# EAGLE design bletka_1 (EAGLE 8.2.0)
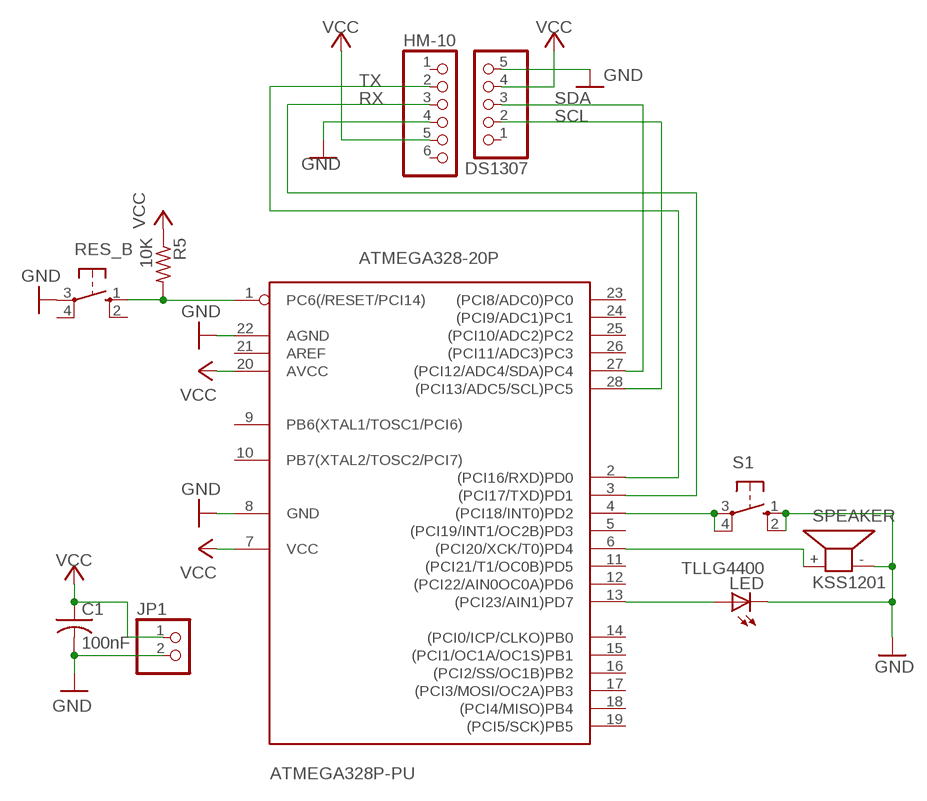
[diagram p0: schematic, sheet 1]

## Parts
ATMEGA328P-PU  ATMEGA328-20P  [DIL28-3]
C1  100nF  C-US050-024X044  [C050-024X044]
DS1307  PINHD-1X5  [1X05]
HM-10  PINHD-1X6  [1X06]
JP1  PINHD-1X2  [1X02]
LED  TLLG4400  [LED3MM]
R5  10K  R-US_0207/10  [0207/10]
RES_B  10-XX  [B3F-10XX]
S1  10-XX  [B3F-10XX]
SPEAKER  KSS1201  [KSS1201]

## Nets
GND: ATMEGA328P-PU.8(GND) ATMEGA328P-PU.22(AGND) C1.2 DS1307.5 HM-10.4 JP1.2 LED.K(C) RES_B.3(P) S1.1(S) S1.2(S1) SPEAKER.-
N$1: ATMEGA328P-PU.4((PCI18/INT0)PD2) S1.3(P) S1.4(P1)
PD4: ATMEGA328P-PU.6((PCI20/XCK/T0)PD4) SPEAKER.+
PD7: ATMEGA328P-PU.13((PCI23/AIN1)PD7) LED.A
RESET: ATMEGA328P-PU.1(PC6(/RESET/PCI14)) R5.2 RES_B.1(S)
RX: ATMEGA328P-PU.3((PCI17/TXD)PD1) HM-10.3
SCL: ATMEGA328P-PU.28((PCI13/ADC5/SCL)PC5) DS1307.2
SDA: ATMEGA328P-PU.27((PCI12/ADC4/SDA)PC4) DS1307.3
TX: ATMEGA328P-PU.2((PCI16/RXD)PD0) HM-10.2
VCC: ATMEGA328P-PU.7(VCC) ATMEGA328P-PU.20(AVCC) C1.1 DS1307.4 HM-10.5 JP1.1 R5.1
Unconnected: ATMEGA328P-PU.5((PCI19/INT1/OC2B)PD3) ATMEGA328P-PU.9(PB6(XTAL1/TOSC1/PCI6)) ATMEGA328P-PU.10(PB7(XTAL2/TOSC2/PCI7)) ATMEGA328P-PU.11((PCI21/T1/OC0B)PD5) ATMEGA328P-PU.12((PCI22/AIN0OC0A)PD6) ATMEGA328P-PU.14((PCI0/ICP/CLKO)PB0) ATMEGA328P-PU.15((PCI1/OC1A/OC1S)PB1) ATMEGA328P-PU.16((PCI2/SS/OC1B)PB2) ATMEGA328P-PU.17((PCI3/MOSI/OC2A)PB3) ATMEGA328P-PU.18((PCI4/MISO)PB4) ATMEGA328P-PU.19((PCI5/SCK)PB5) ATMEGA328P-PU.21(AREF) ATMEGA328P-PU.23((PCI8/ADC0)PC0) ATMEGA328P-PU.24((PCI9/ADC1)PC1) ATMEGA328P-PU.25((PCI10/ADC2)PC2) ATMEGA328P-PU.26((PCI11/ADC3)PC3) DS1307.1 HM-10.1 HM-10.6 RES_B.2(S1) RES_B.4(P1)

## Library data of the parts
ATMEGA328P-PU = atmega328:ATMEGA328*P: MICROCONTROLLER 32 kBytes FLASH 2 kBytes SRAM 1 kBytes EEPROM USART 8-channel 10 bit ADC
C1 = adafruit:C-US: CAPACITOR, American symbol
DS1307 = pinhead:PINHD-1X5: PIN HEADER
HM-10 = pinhead:PINHD-1X6: PIN HEADER
JP1 = pinhead:PINHD-1X2: PIN HEADER
LED = led:TLLG4400: Low Current (2mA) LED 3 mm Tinted Diffused Package color GREEN Source: Data sheet <http://www.farnell.com/datasheets/391098.pdf>; MF: VISHAY SEMICONDUCTOR; OC_FARNELL: 1612435
R5 = adafruit:R-US_: RESISTOR, American symbol
RES_B S1 = switch-omron:10-XX: OMRON SWITCH; MPN: B3F-1000; OC_FARNELL: 176432; OC_NEWARK: 36M3542
SPEAKER = buzzer:KSS1201: SPEAKER Source: Schukat; OC_FARNELL: unknown; OC_NEWARK: unknown

## Net classes
0 default: width 0.5 mm

## Board
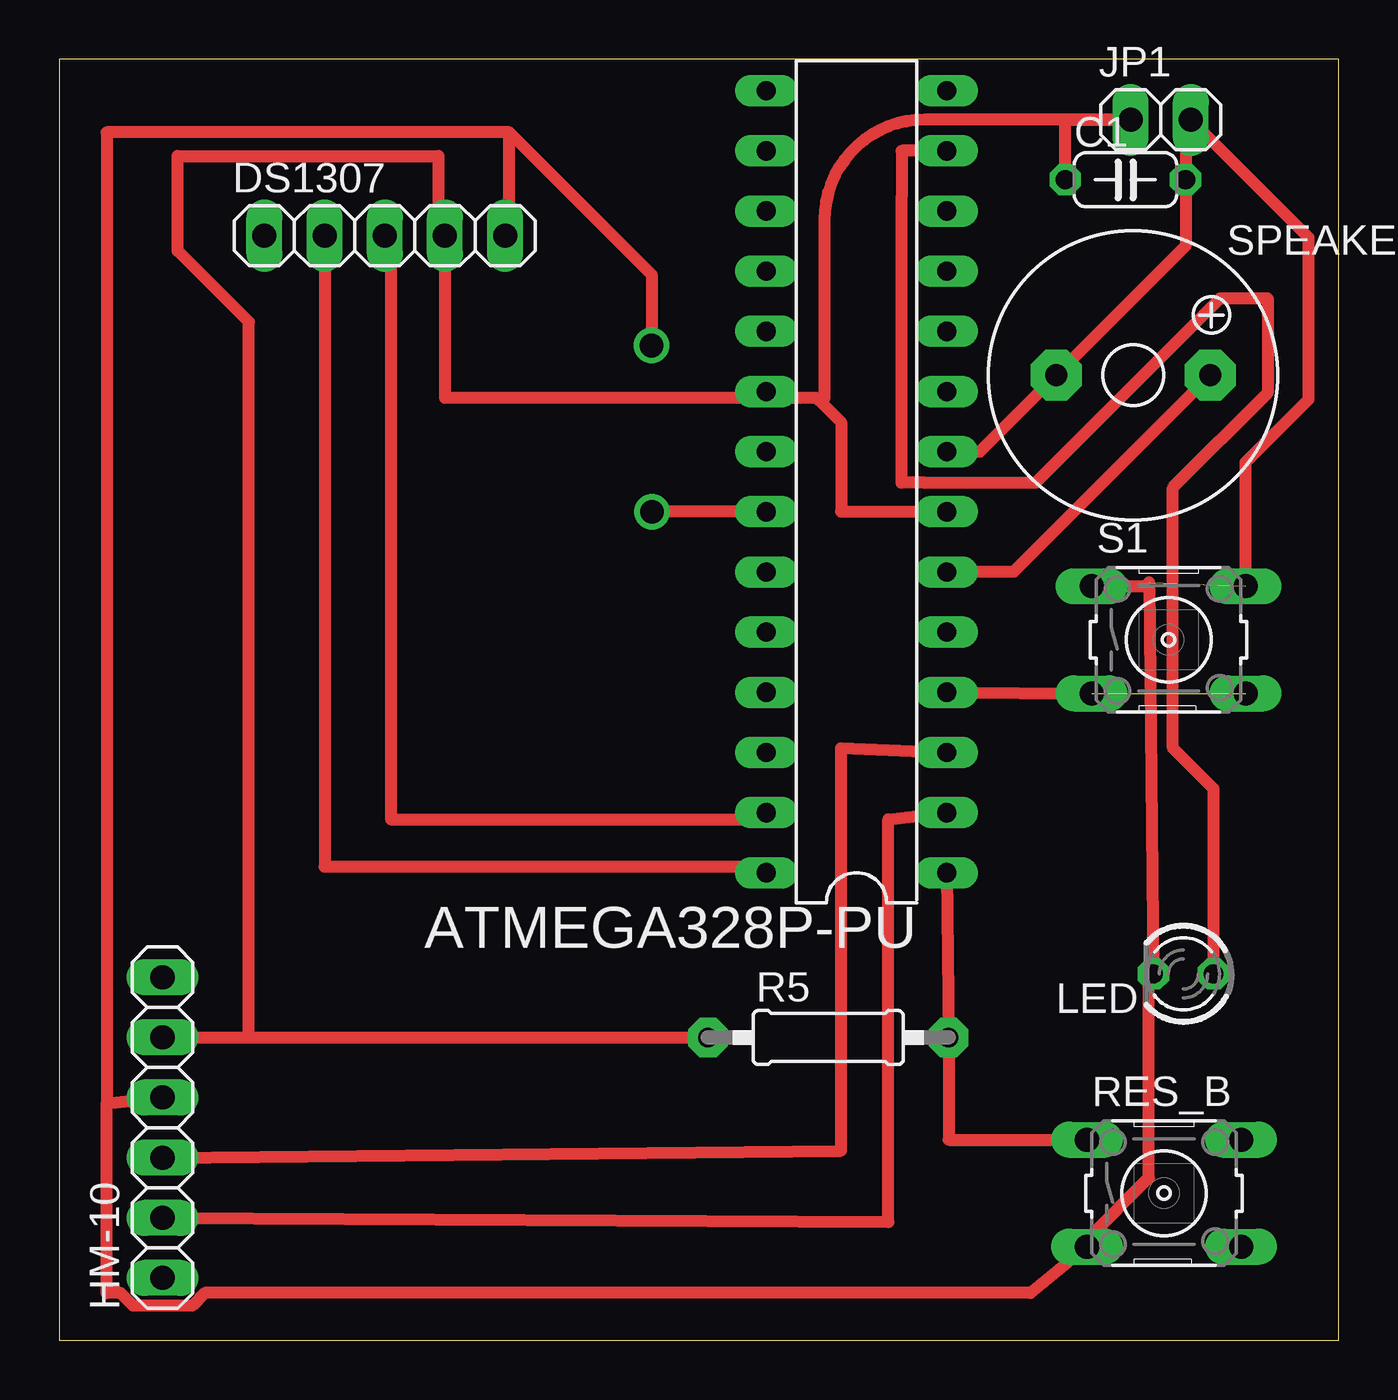
[diagram p1: board, top side]
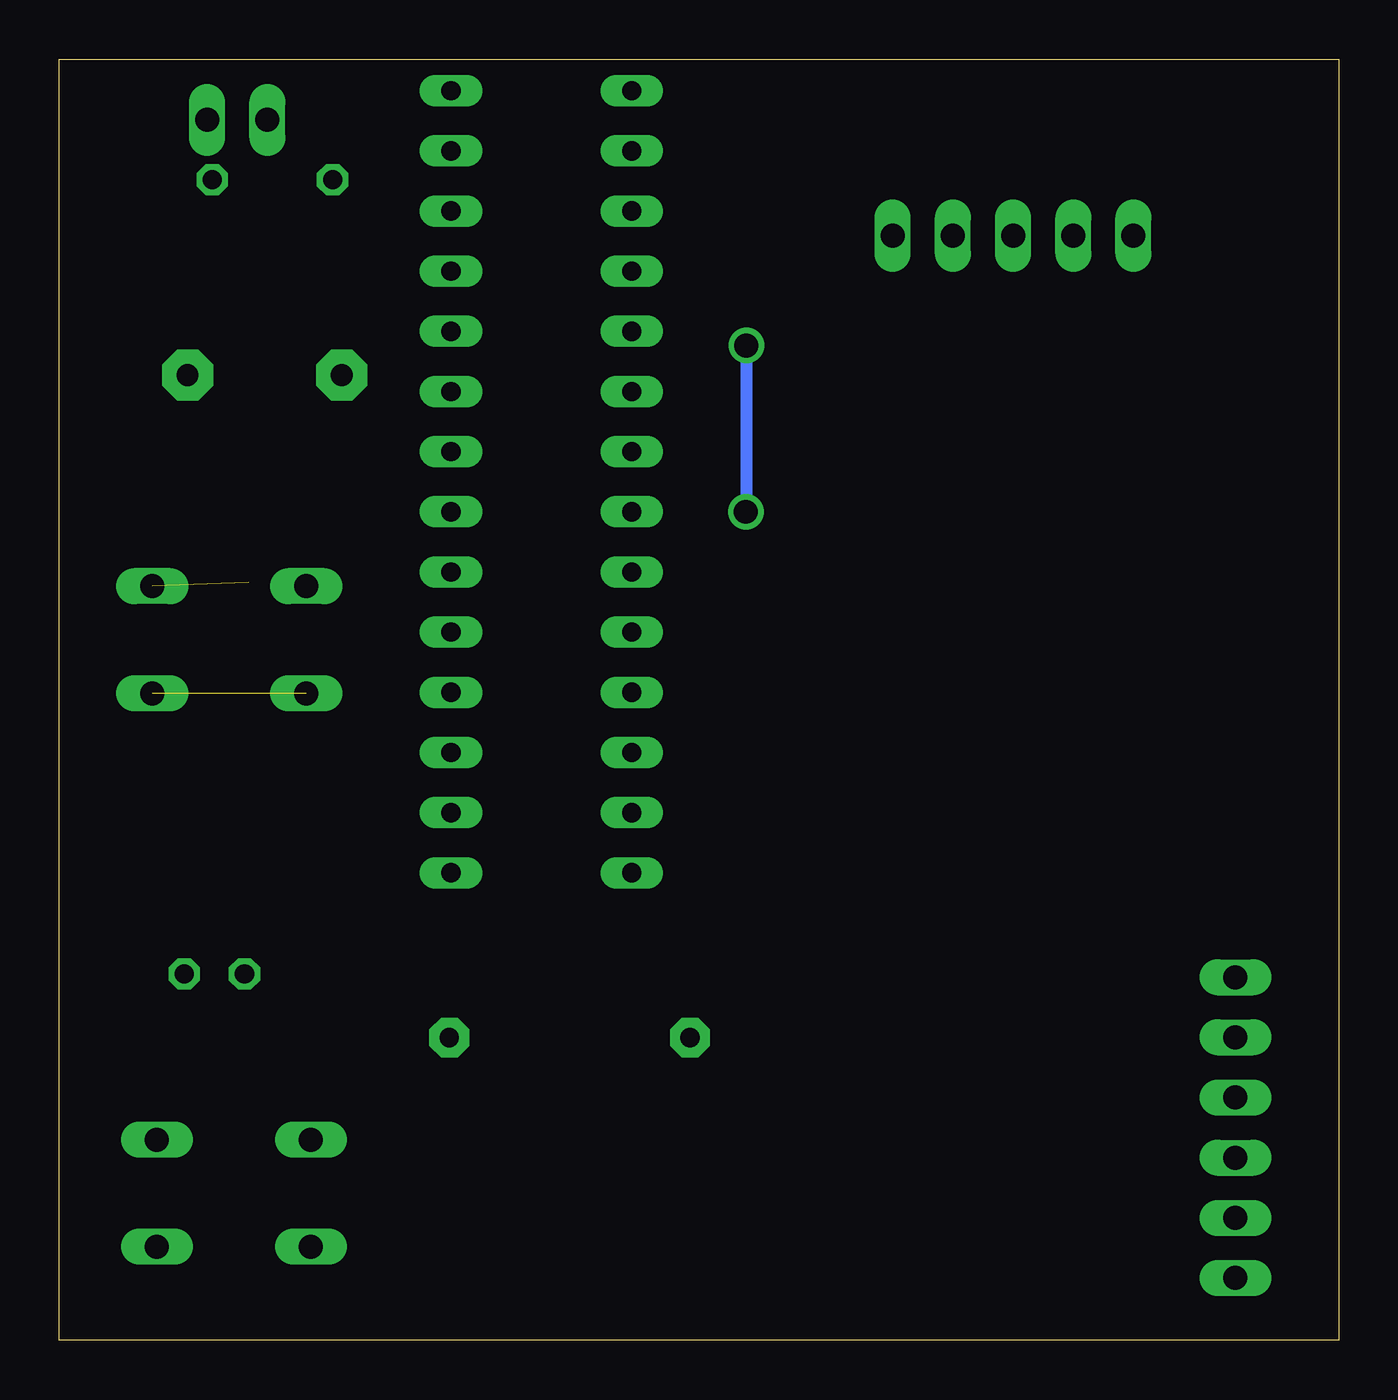
[diagram p2: board, bottom side, seen from below]

Size 54 x 54.09 mm. Coordinates in mm from the lower left corner, seen from the top.
Outline: 0,0 54,0 54,54.09 0,54.09 0,0
Copper layers (1*16): Top 0.035mm / dielectric 1.5mm / Bottom 0.035mm
Design rules "default": minimum track width 6mil, minimum drill 0.35mm, track to track 6mil, track to pad 6mil, pad to pad 6mil, via to via 6mil, smd to smd 6mil, copper to edge 40mil, drill to drill 6mil, minimum pad ring 10mil, minimum via ring 8mil, stop-mask expansion 4mil, vias tented up to drill 0mil, thermal gap 10mil

### Footprints (pad centres in the part's own frame; a part is rotated, then mirrored left to right if it is on the bottom)
DIL28-3 = drill 0.813 long: 1 -16.51,-3.81; 2 -13.97,-3.81; 3 -11.43,-3.81; 4 -8.89,-3.81; 5 -6.35,-3.81; 6 -3.81,-3.81; 7 -1.27,-3.81; 8 1.27,-3.81; 9 3.81,-3.81; 10 6.35,-3.81; 11 8.89,-3.81; 12 11.43,-3.81; 13 13.97,-3.81; 14 16.51,-3.81; 15 16.51,3.81; 16 13.97,3.81; 17 11.43,3.81; 18 8.89,3.81; 19 6.35,3.81; 20 3.81,3.81; 21 1.27,3.81; 22 -1.27,3.81; 23 -3.81,3.81; 24 -6.35,3.81; 25 -8.89,3.81; 26 -11.43,3.81; 27 -13.97,3.81; 28 -16.51,3.81
C050-024X044 = drill 0.813 octagon: 1 -2.54,0; 2 2.54,0
1X05 = drill 1.016 long: 1 -5.08,0; 2 -2.54,0; 3 0,0; 4 2.54,0; 5 5.08,0
1X06 = drill 1.016 long: 1 -6.35,0; 2 -3.81,0; 3 -1.27,0; 4 1.27,0; 5 3.81,0; 6 6.35,0
1X02 = drill 1.016 long: 1 -1.27,0; 2 1.27,0
LED3MM = drill 0.813 octagon: A -1.27,0; K 1.27,0
0207/10 = drill 0.813 pad 1.676 octagon: 1 -5.08,0; 2 5.08,0
B3F-10XX = drill 1.016 long: 1 -3.251,2.261; 2 3.251,2.261; 3 -3.251,-2.261; 4 3.251,-2.261
KSS1201 = drill 0.914 pad 2.159 octagon: + 3.251,0; - -3.251,0

### Placement (x,y rotation side)
ATMEGA328P-PU  33.65,36.25 90 top
C1  45,49 0 top
DS1307  13.74,46.64 0 top
HM-10  4.36,8.98 90 top
JP1  46.49,51.53 0 top
LED  47.45,15.47 180 top
R5  32.46,12.78 0 top
RES_B  46.63,6.21 0 top
S1  46.82,29.58 0 top
SPEAKER  45.33,40.75 0 top

### Tracks (layer width: path | path; a pad name or v marks a point on that pad's centre or on a via)
GND  (via drill 1)  (1 unrouted)
  Top 0.5: LED.K 45.99,15.33 45.99,6.85 43.38,4.24 RES_B.3
  Top 0.508: LED.K 46,32 45.84,31.84 S1.1 | RES_B.3 41,2 6.14,2 5.61,1.46 3.11,1.46 2.58,2 2,2 2,10 | 2,10 HM-10.4 | 2,10 2,51 19,51 | S1.2 50.07,37.07 52.73,39.73 52.73,46.56 JP1.2 47.54,51.31 C1.2 47.54,46.21 SPEAKER.- 38.85,37.52 ATMEGA328P-PU.8 | ATMEGA328P-PU.22 v25.02,34.98 | DS1307.5 19,46.82 19,51 | 19,51 25,45 v25,42
  Bottom 0.508: v25,42 25,35 v25.02,34.98
N$1  (1 unrouted)
  Top 0.508: ATMEGA328P-PU.4 S1.3
PD4
  Top 0.508: SPEAKER.+ 40.27,32.44 ATMEGA328P-PU.6
PD7
  Top 0.5: 36.53,36.21 40.8,36.21 | 35.56,37.19 35.56,48.28 | 48.93,15.66 LED.A | 37.19,49.91 ATMEGA328P-PU.13
  Top 0.508: ATMEGA328P-PU.13 35.56,50.22 35.56,48.28 | 36.53,36.21 35.56,36.21 35.56,37.19 | LED.A 48.72,23.28 47,25 47,36 51,40 51,44 49,44 41.21,36.21 40.8,36.21
RESET
  Top 0.508: ATMEGA328P-PU.1 R5.2 37.54,8.47 RES_B.1
RX
  Top 0.508: HM-10.3 33,8 33,25 ATMEGA328P-PU.3
SCL
  Top 0.508: ATMEGA328P-PU.28 29.58,20 11.2,20 DS1307.2
SDA
  Top 0.508: ATMEGA328P-PU.27 29.84,22 14,22 14,46.38 DS1307.3
TX
  Top 0.508: HM-10.2 35,5 35,22 ATMEGA328P-PU.2
VCC
  Top 0.5: 36.53,35.23 37.19,35.23 ATMEGA328P-PU.7 | 16.31,46.32 DS1307.4 | 29.68,40.12 ATMEGA328P-PU.20 30.01,39.8 31.97,39.8 32.13,39.63 32.29,39.8 32.29,47.3 | 45.02,51.54 44,51.54 42.46,51.54 36.53,51.54
  Top 0.508: HM-10.5 7,12.79 8,12.79 | 8,12.79 9,12.79 R5.1 | 8,12.79 8,43 | 8,43 | 8,43 5,46 5,50 16,50 16,46.32 16.31,46.32 | 31.97,39.8 33,38.76 33,35 33.02,34.98 ATMEGA328P-PU.7 | 36.53,51.54 arc90 32.29,47.3 | DS1307.4 16.28,39.8 30.01,39.8 | 44,51.54 44,51.53 JP1.1 | C1.1 42.46,51.53 JP1.1 | JP1.1 42.46,51.54